# EAGLE schematic MTX_Tap_an_er_V11 (EAGLE 6.5.0)

## Sheet 1 of 2
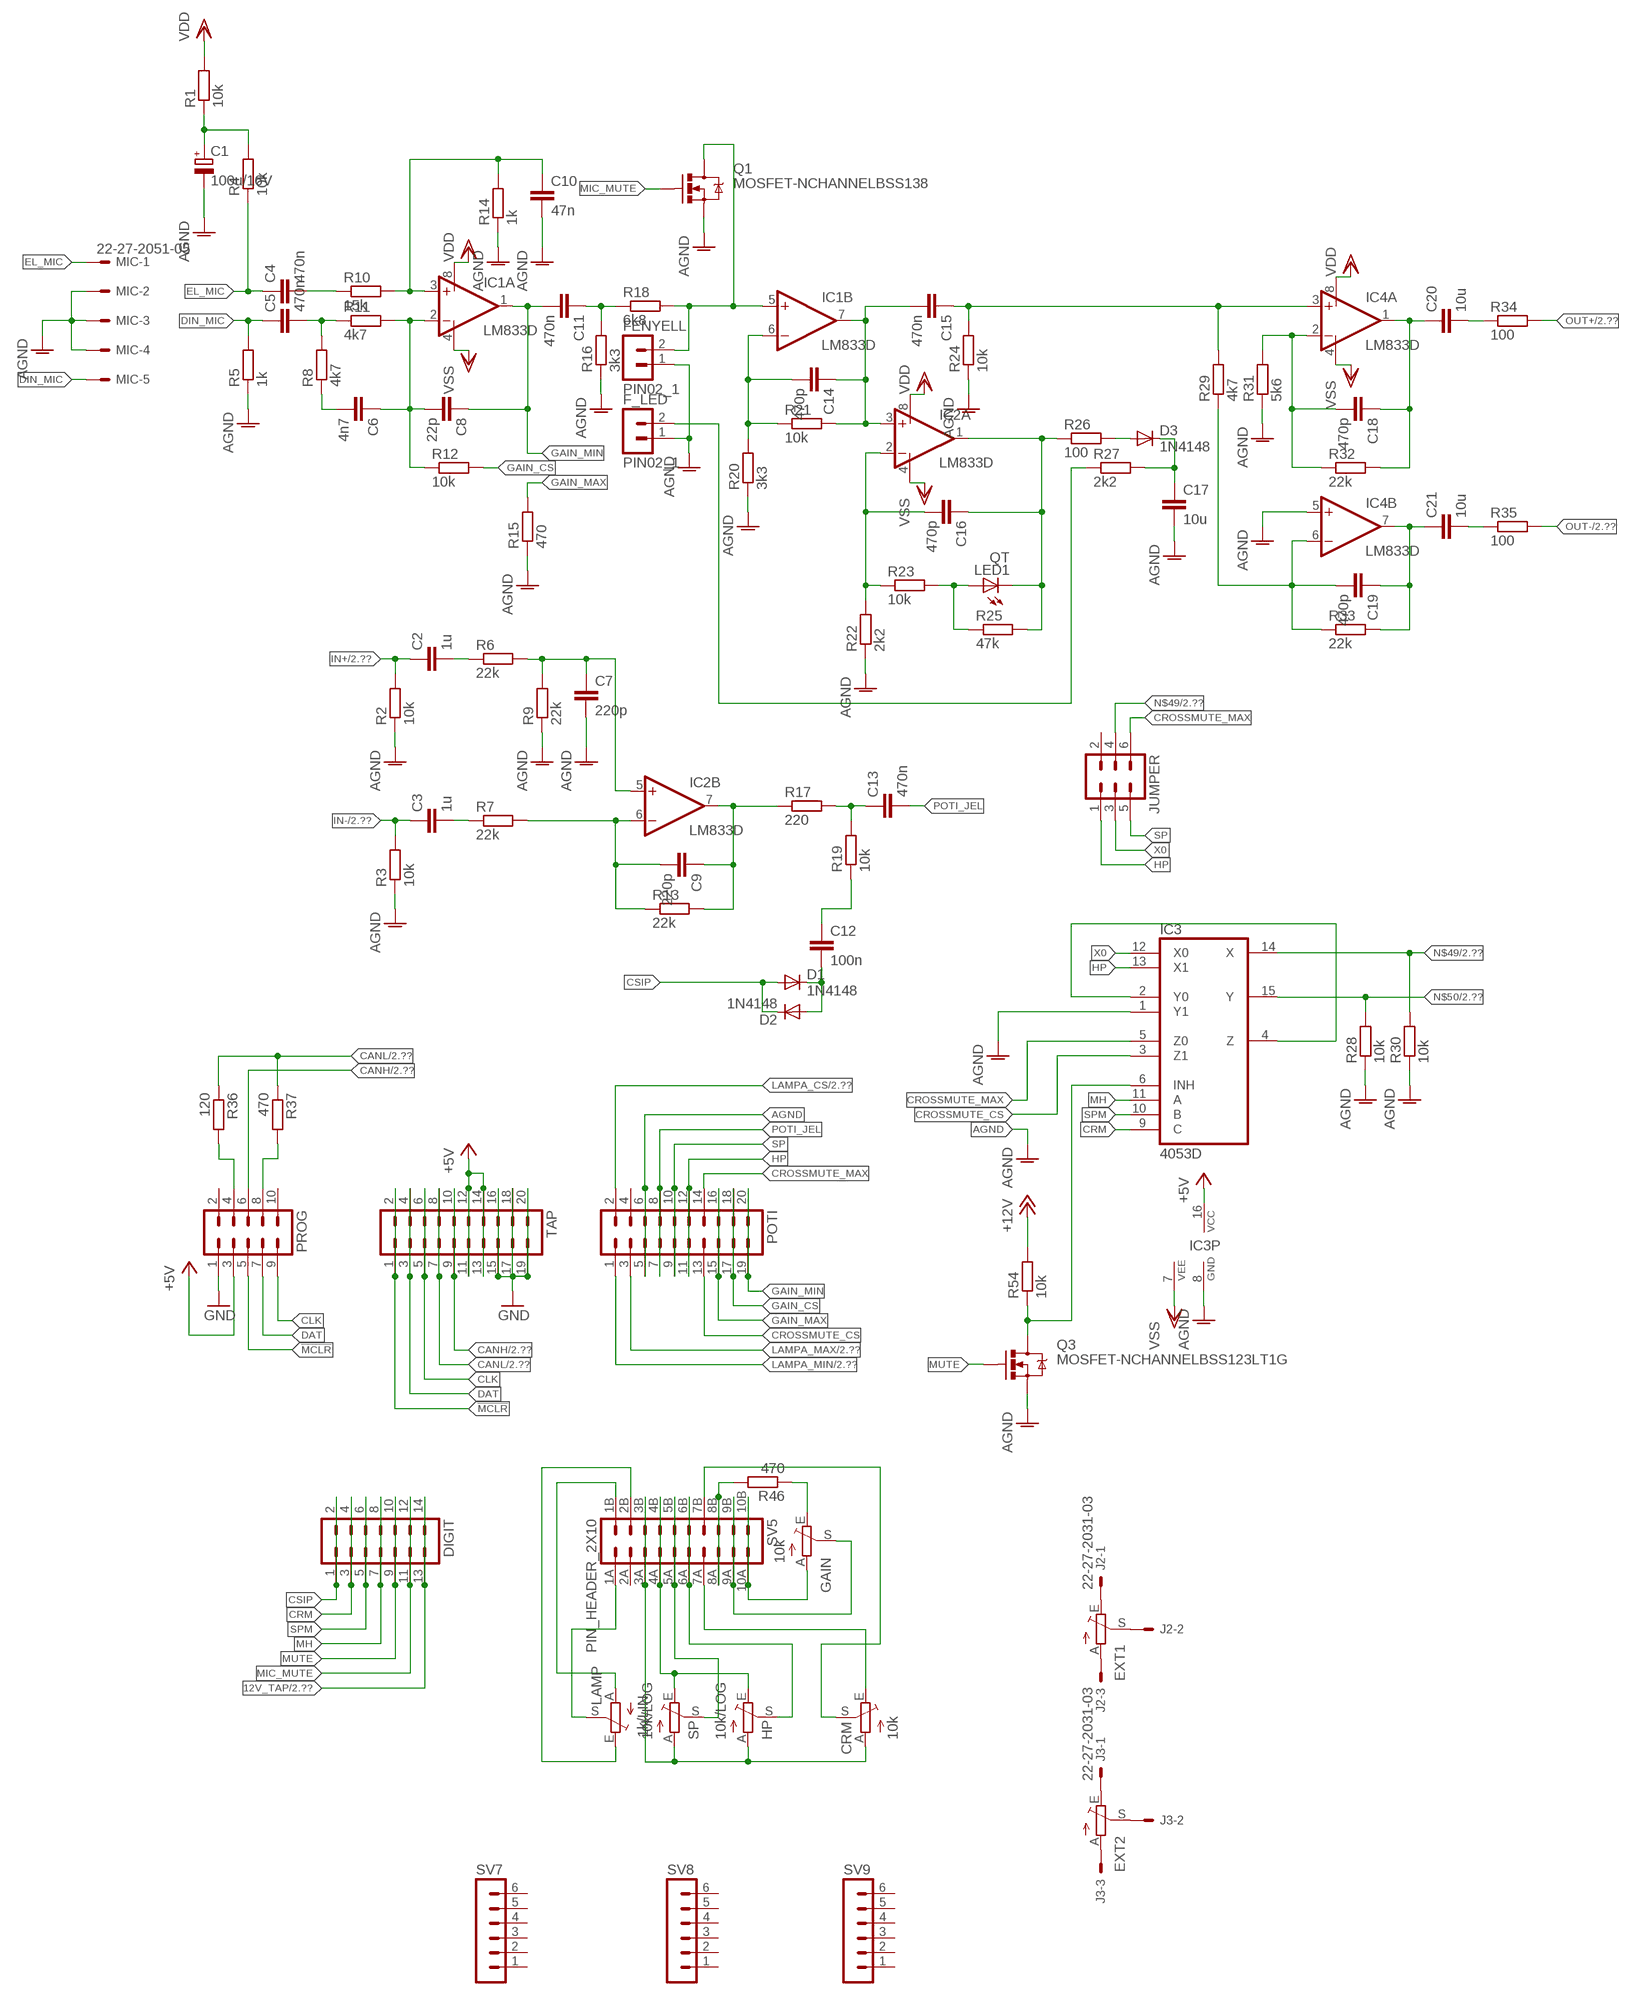
[diagram p0: schematic, sheet 1]

### Parts
C1  100u/16V  CPOL-EUE2.5-5  [E2,5-5]
C2  1u  C-EUC0805  [C0805]
C3  1u  C-EUC0805  [C0805]
C4  470n  C-EUC0805  [C0805]
C5  470n  C-EUC0805  [C0805]
C6  4n7  C-EUC0805  [C0805]
C7  220p  C-EUC0805  [C0805]
C8  22p  C-EUC0805  [C0805]
C9  220p  C-EUC0805  [C0805]
C10  47n  C-EUC0805  [C0805]
C11  470n  C-EUC0805  [C0805]
C12  100n  C-EUC0805  [C0805]
C13  470n  C-EUC0805  [C0805]
C14  470p  C-EUC0805  [C0805]
C15  470n  C-EUC0805  [C0805]
C16  470p  C-EUC0805  [C0805]
C17  10u  C-EUC0805  [C0805]
C18  470p  C-EUC0805  [C0805]
C19  470p  C-EUC0805  [C0805]
C20  10u  C-EUC0805  [C0805]
C21  10u  C-EUC0805  [C0805]
CRM  10k  TRIM_EU-PT10  [PT-10]
D1  1N4148  DIODE-SOD80C  [SOD80C]
D2  1N4148  DIODE-SOD80C  [SOD80C]
D3  1N4148  DIODE-SOD80C  [SOD80C]
DIGIT  MA07-2  [MA07-2]
EXT1  TRIM_EU-PT10  [PT-10]
EXT2  TRIM_EU-PT10  [PT-10]
F_LED  PIN02_1  [PIN02_1]
FENYELL  PIN02_1  [PIN02_1]
GAIN  10k  TRIM_EU-PT10  [PT-10]
HP  10k/LOG  TRIM_EU-POT_WHOLE  [POT_NAR]
IC1  LM833D  [SO08]
IC2  LM833D  [SO08]
IC3  4053D  [SO16]
IC4  LM833D  [SO08]
J2  22-27-2031-03  [6410-03]
J3  22-27-2031-03  [6410-03]
JUMPER  MA03-2  [MA03-2]
LAMP  1k/LIN  TRIM_EU-POT_WHOLE  [POT_NAR]
LED1  QT  LED3MM  [LED3MM]
MIC  22-27-2051-05  [6410-05]
POTI  MA10-2  [MA10-2]
PROG  ML10L  [ML10L]
Q1  MOSFET-NCHANNELBSS138  [SOT23]
Q3  MOSFET-NCHANNELBSS123LT1G  [SOT23]
R1  10k  R-EU_R0805  [R0805]
R2  10k  R-EU_R0805  [R0805]
R3  10k  R-EU_R0805  [R0805]
R4  10k  R-EU_R0805  [R0805]
R5  1k  R-EU_R0805  [R0805]
R6  22k  R-EU_R0805  [R0805]
R7  22k  R-EU_R0805  [R0805]
R8  4k7  R-EU_R0805  [R0805]
R9  22k  R-EU_R0805  [R0805]
R10  15k  R-EU_R0805  [R0805]
R11  4k7  R-EU_R0805  [R0805]
R12  10k  R-EU_R0805  [R0805]
R13  22k  R-EU_R0805  [R0805]
R14  1k  R-EU_R0805  [R0805]
R15  470  R-EU_R0805  [R0805]
R16  3k3  R-EU_R0805  [R0805]
R17  220  R-EU_R0805  [R0805]
R18  6k8  R-EU_R0805  [R0805]
R19  10k  R-EU_R0805  [R0805]
R20  3k3  R-EU_R0805  [R0805]
R21  10k  R-EU_R0805  [R0805]
R22  2k2  R-EU_R0805  [R0805]
R23  10k  R-EU_R0805  [R0805]
R24  10k  R-EU_R0805  [R0805]
R25  47k  R-EU_R0805  [R0805]
R26  100  R-EU_R0805  [R0805]
R27  2k2  R-EU_R0805  [R0805]
R28  10k  R-EU_R0805  [R0805]
R29  4k7  R-EU_R0805  [R0805]
R30  10k  R-EU_R0805  [R0805]
R31  5k6  R-EU_R0805  [R0805]
R32  22k  R-EU_R0805  [R0805]
R33  22k  R-EU_R0805  [R0805]
R34  100  R-EU_R0805  [R0805]
R35  100  R-EU_R0805  [R0805]
R36  120  R-EU_R0805  [R0805]
R37  470  R-EU_R0805  [R0805]
R46  470  R-EU_R0805  [R0805]
R54  10k  R-EU_R0805  [R0805]
SP  10k/LOG  TRIM_EU-POT_WHOLE  [POT_NAR]
SV5  PIN_HEADER_2X10  [PIN_HEADER_2X10SMD]
SV7  MA06-1  [MA06-1]
SV8  MA06-1  [MA06-1]
SV9  MA06-1  [MA06-1]
TAP  MA10-2  [MA10-2]

### Nets
1.: C9.1 IC2.7(B:OUT) R13.2 R17.1
12V_TAP: DIGIT.13 DIGIT.14 ; also sheet 2
!MCLR: PROG.5 TAP.1 TAP.2
+5V: IC3.16(VCC) PROG.3 TAP.11 TAP.12 TAP.13 TAP.14 ; also sheet 2
+12V: R54.2 ; also sheet 2
AGND: C1.- C7.2 C10.2 C17.2 F_LED.1 FENYELL.1 IC3.1(Y1) IC3.8(GND) IC4.5(B:+IN) MIC.2 MIC.3 MIC.4 POTI.5 POTI.6 Q1.2(S) Q3.2(S) R2.1 R3.1 R5.1 R9.1 R14.1 R15.1 R16.1 R20.1 R22.1 R24.1 R28.1 R30.1 R31.1 ; also sheet 2
CANH: PROG.6 TAP.9 TAP.10 ; also sheet 2
CANL: R36.1 R37.1 TAP.7 TAP.8 ; also sheet 2
CLK: PROG.9 TAP.5 TAP.6
CRM: DIGIT.3 DIGIT.4 IC3.9(C)
CROSSMUTE_CS: IC3.3(Z1) POTI.13
CROSSMUTE_MAX: IC3.5(Z0) JUMPER.6 POTI.14
CSIP: D1.A D2.C DIGIT.1 DIGIT.2
DAT: PROG.7 TAP.3 TAP.4
DIN_MIC: C5.1 MIC.5 R5.2
EL_MIC: C4.1 MIC.1 R4.1
GAIN_CS: POTI.17 POTI.18 R12.2
GAIN_MAX: POTI.15 POTI.16 R15.2
GAIN_MIN: C8.1 C11.2 IC1.1(A:OUT) POTI.19 POTI.20
GND: PROG.1 TAP.15 TAP.16 TAP.17 TAP.18 TAP.19 TAP.20 ; also sheet 2
HP: IC3.13(X1) JUMPER.1 POTI.11 POTI.12
IN+: C2.1 R2.2 ; also sheet 2
IN-: C3.1 R3.2 ; also sheet 2
LAMPA_CS: POTI.2 ; also sheet 2
LAMPA_MAX: POTI.3 ; also sheet 2
LAMPA_MIN: POTI.1 ; also sheet 2
MH: DIGIT.7 DIGIT.8 IC3.11(A)
MIC_MUTE: DIGIT.11 DIGIT.12 Q1.1(G)
MUTE: DIGIT.9 DIGIT.10 Q3.1(G)
N$1: C1.+ R1.1 R4.2
N$2: C4.2 R10.1
N$3: C5.2 R8.2 R11.1
N$4: C10.1 IC1.3(A:+IN) R10.2 R14.2
N$5: C6.1 C8.2 IC1.2(A:-IN) R11.2 R12.1
N$8: C6.2 R8.1
N$9: FENYELL.2 IC1.5(B:+IN) Q1.3(D) R18.2
N$10: CRM.E SV5.7A
N$11: CRM.A HP.A SP.A SV5.3A SV5.3B
N$12: IC3.2(Y0) IC3.4(Z)
N$13: C11.1 R16.2 R18.1
N$14: C18.2 IC4.2(A:-IN) R31.2 R32.1
N$15: C18.1 C20.1 IC4.1(A:OUT) R32.2
N$16: C14.2 IC1.6(B:-IN) R20.2 R21.1
N$17: C14.1 C15.2 IC1.7(B:OUT) IC2.3(A:+IN) R21.2
N$18: C16.2 IC2.2(A:-IN) R22.2 R23.1
N$19: C19.2 IC4.6(B:-IN) R29.1 R33.1
N$20: LED1.A R23.2 R25.1
N$21: C16.1 IC2.1(A:OUT) LED1.K(C) R25.2 R26.1
N$22: D3.A R26.2
N$23: C17.1 D3.C R27.2
N$24: F_LED.2 R27.1
N$25: C15.1 IC4.3(A:+IN) R24.2 R29.2
N$26: C19.1 C21.1 IC4.7(B:OUT) R33.2
N$27: C21.2 R35.1
N$28: C20.2 R34.1
N$29: C2.2 R6.1
N$30: HP.E SP.E SV5.4A SV5.4B
N$31: C7.1 IC2.5(B:+IN) R6.2 R9.2
N$32: C3.2 R7.1
N$33: SP.S SV5.5A SV5.5B
N$35: C12.2 D1.C D2.A
N$36: C9.2 IC2.6(B:-IN) R7.2 R13.1
N$37: EXT1.S J2.2
N$38: EXT2.S J3.2
N$39: C13.1 R17.2 R19.2
N$40: C12.1 R19.1
N$41: EXT1.E J2.1
N$42: EXT1.A J2.3
N$43: LAMP.S SV5.1A
N$44: EXT2.A J3.3
N$45: EXT2.E J3.1
N$47: LAMP.E SV5.2B
N$48: HP.S SV5.6A SV5.6B
N$49: IC3.14(X) JUMPER.4 R30.2 ; also sheet 2
N$50: IC3.15(Y) R28.2 ; also sheet 2
N$51: PROG.8 R37.2
N$56: LAMP.A SV5.1B
N$57: PROG.4 R36.2
N$58: CRM.S SV5.7B
N$59: IC3.6(INH) Q3.3(D) R54.1
N$68: R46.2 SV5.8A SV5.8B
N$69: GAIN.S SV5.9A SV5.9B
N$70: GAIN.A SV5.10A SV5.10B
N$73: GAIN.E R46.1
OUT+: R34.2 ; also sheet 2
OUT-: R35.2 ; also sheet 2
POTI_JEL: C13.2 POTI.7 POTI.8
SP: JUMPER.5 POTI.9 POTI.10
SPM: DIGIT.5 DIGIT.6 IC3.10(B)
VDD: IC1.8(P:V+) IC2.8(P:V+) IC4.8(P:V+) R1.2 ; also sheet 2
VSS: IC1.4(P:V-) IC2.4(P:V-) IC3.7(VEE) IC4.4(P:V-) ; also sheet 2
X0: IC3.12(X0) JUMPER.3
Unconnected: JUMPER.2 POTI.4 PROG.2 PROG.10 SV5.2A SV7.1 SV7.2 SV7.3 SV7.4 SV7.5 SV7.6 SV8.1 SV8.2 SV8.3 SV8.4 SV8.5 SV8.6 SV9.1 SV9.2 SV9.3 SV9.4 SV9.5 SV9.6

## Sheet 2 of 2
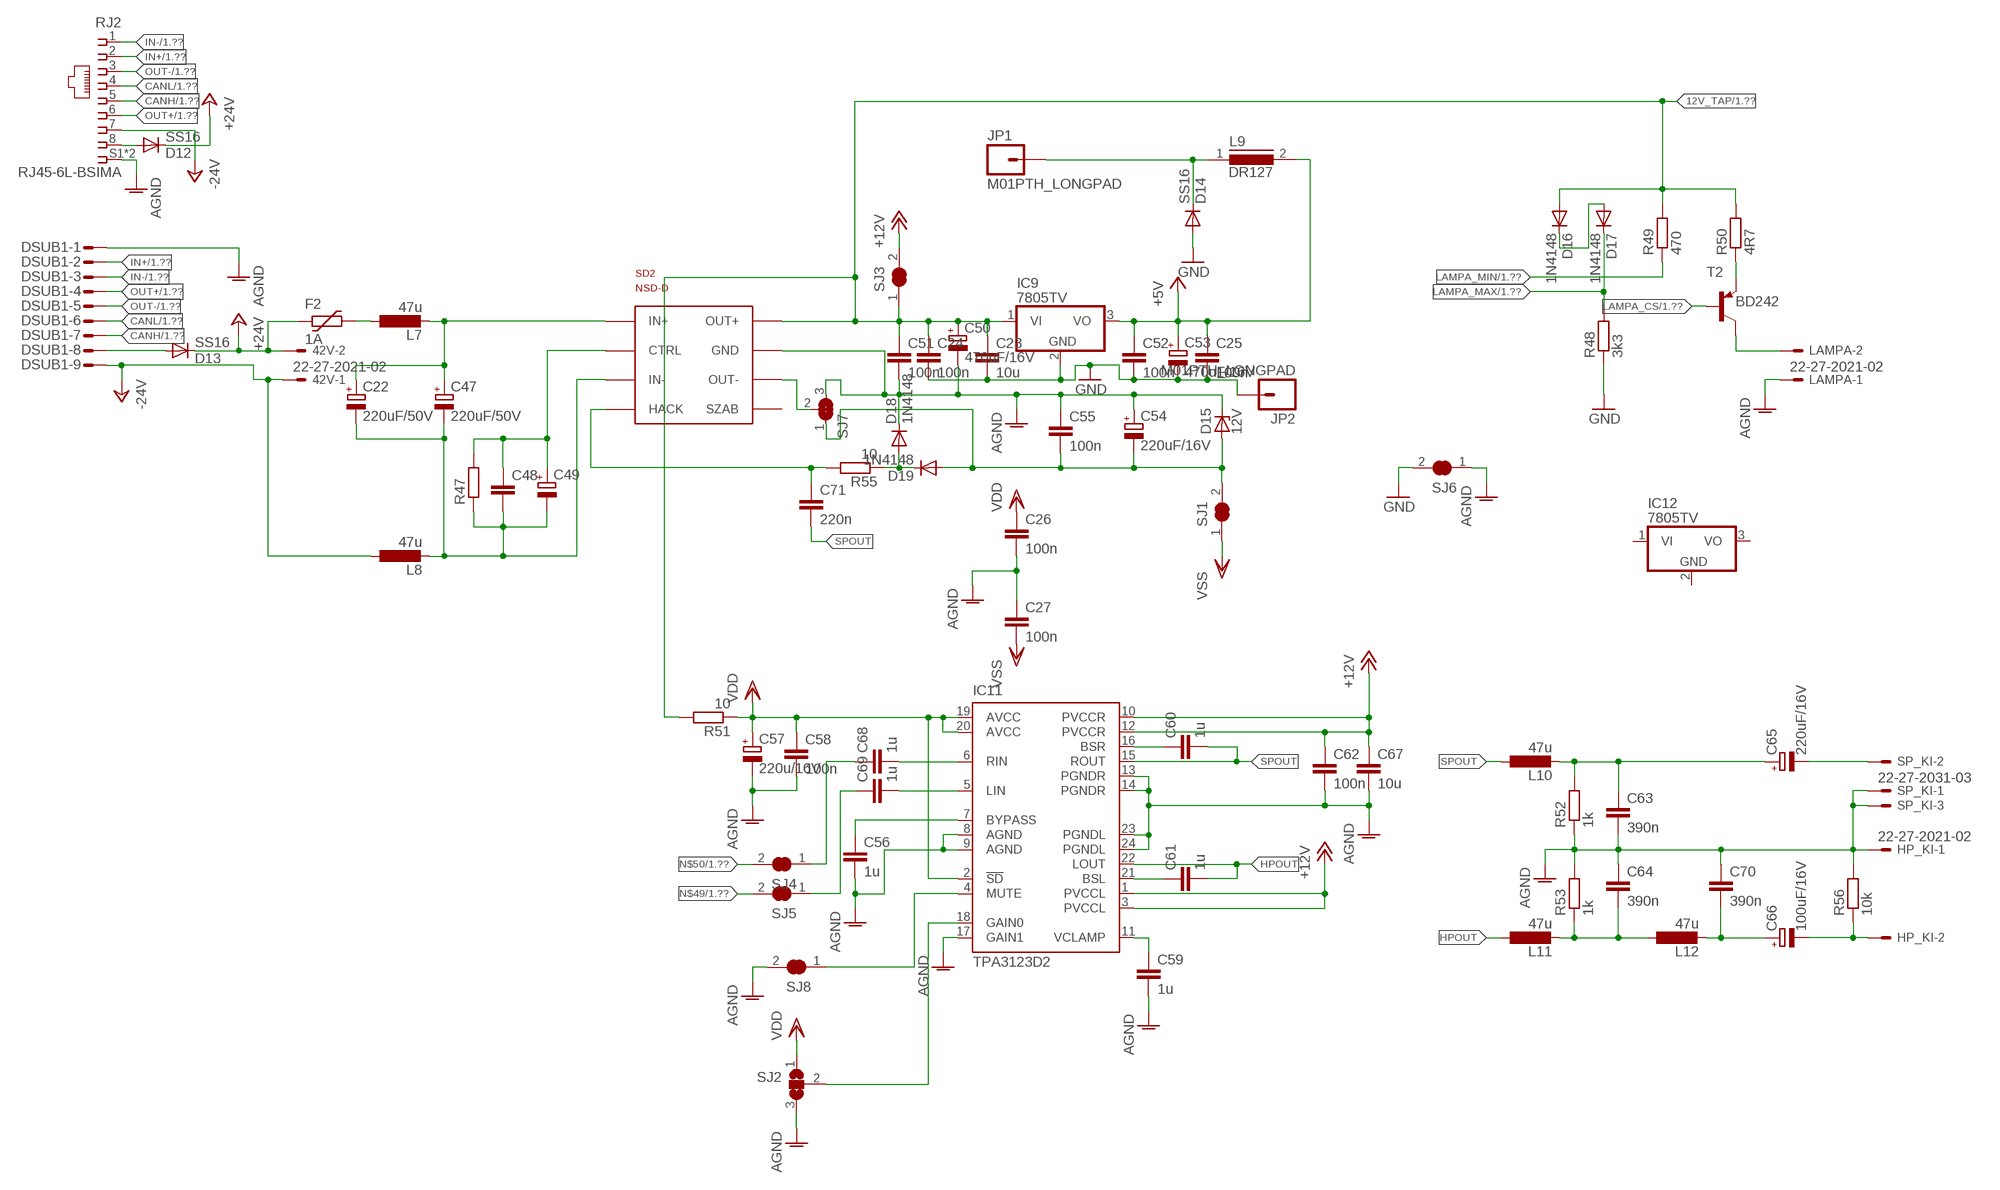
[diagram p1: schematic, sheet 2]

### Parts
42V  22-27-2021-02  [6410-02]
C22  220uF/50V  CPOL-EUE3.5-8  [E3,5-8]
C23  10u  C-EUC0805  [C0805]
C24  100n  C-EUC0805  [C0805]
C25  100n  C-EUC0805  [C0805]
C26  100n  C-EUC0805  [C0805]
C27  100n  C-EUC0805  [C0805]
C47  220uF/50V  CPOL-EUE3.5-8  [E3,5-8]
C48  C-EUC0805  [C0805]
C49  CPOL-EUE2.5-5  [E2,5-5]
C50  470uF/16V  CPOL-EUE3.5-8  [E3,5-8]
C51  100n  C-EUC0805  [C0805]
C52  100n  C-EUC0805  [C0805]
C53  470uF/16V  CPOL-EUE3.5-8  [E3,5-8]
C54  220uF/16V  CPOL-EUE2.5-7  [E2,5-7]
C55  100n  C-EUC0805  [C0805]
C56  1u  C-EUC0805  [C0805]
C57  220u/16V  CPOL-EUE2.5-7  [E2,5-7]
C58  100n  C-EUC0805  [C0805]
C59  1u  C-EUC0805  [C0805]
C60  1u  C-EUC0805  [C0805]
C61  1u  C-EUC0805  [C0805]
C62  100n  C-EUC0805  [C0805]
C63  390n  C-EUC0805  [C0805]
C64  390n  C-EUC0805  [C0805]
C65  220uF/16V  CPOL-EUE2.5-7  [E2,5-7]
C66  100uF/16V  CPOL-EUE2.5-6  [E2,5-6]
C67  10u  C-EUC0805  [C0805]
C68  1u  C-EUC0805  [C0805]
C69  1u  C-EUC0805  [C0805]
C70  390n  C-EUC0805  [C0805]
C71  220n  C-EUC0805  [C0805]
D12  SS16  DIODE-DO-214AC  [DO-214AC]
D13  SS16  DIODE-DO-214AC  [DO-214AC]
D14  SS16  DIODE-DO-214AC  [DO-214AC]
D15  12V  ZENER-DIODESOD80C  [SOD80C]
D16  1N4148  DIODE-SOD80C  [SOD80C]
D17  1N4148  DIODE-SOD80C  [SOD80C]
D18  1N4148  DIODE-SOD80C  [SOD80C]
D19  1N4148  DIODE-SOD80C  [SOD80C]
DSUB1  M09-182S  [182-009-MALE]
F2  1A  FUSE_PTC-1812  [PTC1812L]
HP_KI  22-27-2021-02  [6410-02]
IC9  7805TV  [TO220V]
IC11  TPA3123D2  [PWP-TSSOP24]
IC12  7805TV  [TO220V]
JP1  M01PTH_LONGPAD  [1X01_LONGPAD]
JP2  M01PTH_LONGPAD  [1X01_LONGPAD]
L7  47u  L-EUPIS2816  [PIS2816]
L8  47u  L-EUPIS2816  [PIS2816]
L9  DR127  [DR127]
L10  47u  L-EUPIS2816  [PIS2816]
L11  47u  L-EUPIS2816  [PIS2816]
L12  47u  L-EUPIS2816  [PIS2816]
LAMPA  22-27-2021-02  [6410-02]
R47  R-EU_R0805  [R0805]
R48  3k3  R-EU_R0805  [R0805]
R49  470  R-EU_R0805  [R0805]
R50  4R7  R-EU_R0805  [R0805]
R51  10  R-EU_R1210  [R1210]
R52  1k  R-EU_R0805  [R0805]
R53  1k  R-EU_R0805  [R0805]
R55  10  R-EU_R0805  [R0805]
R56  10k  R-EU_R0805  [R0805]
RJ2  RJ45-6L-BSIMA  [RJ45]
SD2  NSD-D  [NSD-D]
SJ1  SOLDERJUMPER_CLOSED  [SOLDERJUMPER_CLOSEDWIRE]
SJ2  SJ2W  [SJ_2]
SJ3  SOLDERJUMPER_CLOSED  [SOLDERJUMPER_CLOSEDWIRE]
SJ4  SOLDERJUMPER_CLOSED  [SOLDERJUMPER_CLOSEDWIRE]
SJ5  SOLDERJUMPER_CLOSED  [SOLDERJUMPER_CLOSEDWIRE]
SJ6  SOLDERJUMPER_CLOSED  [SOLDERJUMPER_CLOSEDWIRE]
SJ7  SOLDERJUMPER_2WAY  [SOLDERJUMPER_2WAY_OPEN_NOPASTE]
SJ8  SOLDERJUMPER_CLOSED  [SOLDERJUMPER_CLOSEDWIRE]
SP_KI  22-27-2031-03  [6410-03]
T2  BD242  -PNP-TO220V  [TO220V]

### Nets
12V_TAP: C23.1 C24.1 C50.+ C51.1 D16.A IC9.1(VI) R49.2 R50.2 R51.2 SD2.OUT+ SJ3.1 ; also sheet 1
+5V: C25.1 C52.1 C53.+ IC9.3(VO) L9.2 ; also sheet 1
+12V: C62.1 C67.1 IC11.1(PVCCL) IC11.3(PVCCL) IC11.10(PVCCR) IC11.12(PVCCR) SJ3.2 ; also sheet 1
+24V: 42V.2 D12.1(C) D13.1(C) F2.1
-24V: 42V.1 DSUB1.9 L8.1 RJ2.7
AGND: C26.2 C27.1 C50.- C51.2 C54.+ C55.1 C56.2 C57.- C58.2 C59.2 C62.2 C63.2 C64.1 C67.2 C70.1 D15.C D18.C DSUB1.1 HP_KI.1 IC11.8(AGND) IC11.9(AGND) IC11.13(PGNDR) IC11.14(PGNDR) IC11.17(GAIN1) IC11.23(PGNDL) IC11.24(PGNDL) LAMPA.1 R52.1 R53.2 R56.2 RJ2.S1(S) RJ2.S2(S) SD2.COMMON(GND) SJ2.3 SJ6.1 SJ7.3 SJ8.2 SP_KI.1 SP_KI.3 ; also sheet 1
CANH: DSUB1.7 RJ2.5 ; also sheet 1
CANL: DSUB1.6 RJ2.4 ; also sheet 1
GND: C23.2 C24.2 C25.2 C52.2 C53.- D14.2(A) IC9.2(GND) JP2.1 R48.1 SJ6.2 ; also sheet 1
HPIN_X: C69.1 SJ5.1
HPOUT: C61.2 IC11.22(LOUT) L11.1
IN+: DSUB1.2 RJ2.2 ; also sheet 1
IN-: DSUB1.3 RJ2.1 ; also sheet 1
LAMPA_CS: T2.1(B) ; also sheet 1
LAMPA_MAX: D17.C R48.2 ; also sheet 1
LAMPA_MIN: R49.1 ; also sheet 1
N$6: C54.- C55.2 D15.A D19.A SJ1.2 SJ7.1
N$7: D12.2(A) RJ2.8
N$34: C65.- SP_KI.2
N$46: SD2.OUT- SJ7.2
N$49: SJ5.2 ; also sheet 1
N$50: SJ4.2 ; also sheet 1
N$55: C71.1 R55.2 SD2.HACK
N$71: D13.2(A) DSUB1.8
N$72: F2.2 L7.1
N$74: C22.+ C47.+ L7.2 SD2.INPUT+(IN+)
N$75: C48.1 C49.+ R47.2 SD2.CONTROL(CTRL)
N$76: C22.- C47.- C48.2 C49.- L8.2 R47.1 SD2.INPUT-(IN-)
N$77: D14.1(C) JP1.1 L9.1
N$78: R50.1 T2.3(E)
N$80: D16.C D17.A
N$81: LAMPA.2 T2.2(C)
N$82: C56.1 IC11.7(BYPASS)
N$83: C59.1 IC11.11(VCLAMP)
N$84: C61.1 IC11.21(BSL)
N$85: C60.1 IC11.16(BSR)
N$86: C63.1 C65.+ L10.2 R52.2
N$87: C64.2 L11.2 L12.1 R53.1
N$89: C66.- HP_KI.2 R56.1
N$90: C68.2 IC11.6(RIN)
N$91: C69.2 IC11.5(LIN)
N$92: IC11.18(GAIN0) SJ2.2
N$93: IC11.4(MUTE) SJ8.1
N$94: D18.A D19.C R55.1
N$95: C66.+ C70.2 L12.2
OUT+: DSUB1.4 RJ2.6 ; also sheet 1
OUT-: DSUB1.5 RJ2.3 ; also sheet 1
SPIN_X: C68.1 SJ4.1
SPOUT: C60.2 C71.2 IC11.15(ROUT) L10.1
VDD: C26.1 C57.+ C58.1 IC11.2(!SD) IC11.19(AVCC) IC11.20(AVCC) R51.1 SJ2.1 ; also sheet 1
VSS: C27.2 SJ1.1 ; also sheet 1
Unconnected: IC12.1(VI) IC12.2(GND) IC12.3(VO) SD2.SZAB

## Library data of the parts
42V HP_KI LAMPA = con-molex:22-?-02: CONNECTOR wire to board 2.54 mm (.1 inch) pitch header; OC_FARNELL: unknown; OC_NEWARK: unknown
C1 C22 C47 C49 C50 C53 C54 C57 C65 C66 = rcl:CPOL-EU: POLARIZED CAPACITOR, European symbol
C2-C21 C23-C27 C48 C51 C52 C55 C56 C58-C64 C67-C71 = rcl:C-EU: CAPACITOR, European symbol
CRM EXT1 EXT2 GAIN HP LAMP SP = pot:TRIM_EU-: POTENTIOMETER
D1-D3 D16-D19 = diode:DIODE-: DIODE
D12-D14 = dp_devices:DIODE: Various Diode Packages
D15 = diode:ZENER-DIODE: Z-Diode
DIGIT = con-lstb:MA07-2: PIN HEADER; OC_FARNELL: unknown; OC_NEWARK: unknown
DSUB1 = con-subd:M09?S: SUB-D; OC_FARNELL: unknown; OC_NEWARK: unknown
F2 = dp_devices:FUSE_PTC: Resettable PTC; TME: BSMD-T1.0A
F_LED FENYELL = Cf_Csatl:PIN02_1
IC1 IC2 IC4 = linear:LM833: OP AMP
IC3 = 40xx:4053: Triple 2-channel ANALOG MULTIPLEXER
IC9 IC12 = linear:78*: Positive VOLTAGE REGULATOR Source: http://cache.national.com/ds/LM/LM78L05.pdf http://www.fairchildsemi.com/ds/LM/LM7805.pdf
IC11 = texas:TPA3123D2: 25-W STEREO CLASS-D AUDIO POWER AMPLIFIER Please INVOKE gate EXP, set DRC-Clearance | Same signals | SMD - SMD = 0 Source: http://focus.ti.com/lit/ds/symlink/tpa3123d2.pdf; MPN: TPA3123D2PWP; OC_FARNELL: 1632099; OC_NEWARK: 53M3994
J2 J3 SP_KI = con-molex:22-?-03: CONNECTOR wire to board 2.54 mm (.1 inch) pitch header; OC_FARNELL: unknown; OC_NEWARK: unknown
JP1 JP2 = SparkFun-Connectors:M01: Header 1 Standard 1-pin 0.1" header. Use with straight break away headers (SKU : PRT-00116), right angle break away headers (PRT-00553), swiss pins (PRT-00743), machine pins (PRT-00117), and female headers (PRT-00115).
JUMPER = con-lstb:MA03-2: PIN HEADER; OC_FARNELL: unknown; OC_NEWARK: unknown
L7 L8 L10-L12 = rcl:L-EU: INDUCTOR, European symbol
L9 = inductors:DR127: High Power Density, High Efficiency, Shielded Inductors Source: coiltronics_dr_series.pdf
LED1 = led:LED: LED OSRAM: - CHIPLED LG R971, LG N971, LY N971, LG Q971, LY Q971, LO R971, LY R971 LH N974, LH R974 LS Q976, LO Q976, LY Q976 LO Q996 - Hyper CHIPLED LW Q18S LB Q993, LB Q99A, LB R99A - SideLED LS A670, LO A670, LY A670, LG A670, LP A670 LB A673, LV A673, LT A673, LW A673 LH A674 LY A675 LS A676, LA A676, LO A676, LY A676, LW A676 LS A679, LY A679, LG A679 - Hyper Micro SIDELED® LS Y876, LA Y876, LO Y876, LY Y876 LT Y87S - SmartLED LW L88C, LW L88S LB L89C, LB L89S, LG L890 LS L89K, LO L89K, LY L89K LS L896, LA L896, LO L896, LY L896 - TOPLED LS T670, LO T670, LY T670, LG T670, LP T670 LSG T670, LSP T670, LSY T670, LOP T670, LYG T670 LG T671, LOG T671, LSG T671 LB T673, LV T673, LT T673, LW T673 LH T674 LS T676, LA T676, LO T676, LY T676, LB T676, LH T676, LSB T676, LW T676 LB T67C, LV T67C, LT T67C, LS T67K, LO T67K, LY T67K, LW E67C LS E67B, LA E67B, LO E67B, LY E67B, LB E67C, LV E67C, LT E67C LW T67C LS T679, LY T679, LG T679 LS T770, LO T770, LY T770, LG T770, LP T770 LB T773, LV T773, LT T773, LW T773 LH T774 LS E675, LA E675, LY E675, LS T675 LS T776, LA T776, LO T776, LY T776, LB T776 LHGB T686 LT T68C, LB T68C - Hyper Mini TOPLED® LB M676 - Mini TOPLED Santana® LG M470 LS M47K, LO M47K, LY M47K Source: http://www.osram.convergy.de LUXEON: - LUMILED® LXK2-PW12-R00, LXK2-PW12-S00, LXK2-PW14-U00, LXK2-PW14-V00 LXK2-PM12-R00, LXK2-PM12-S00, LXK2-PM14-U00 LXK2-PE12-Q00, LXK2-PE12-R00, LXK2-PE12-S00, LXK2-PE14-T00, LXK2-PE14-U00 LXK2-PB12-K00, LXK2-PB12-L00, LXK2-PB12-M00, LXK2-PB14-N00, LXK2-PB14-P00, LXK2-PB14-Q00 LXK2-PR12-L00, LXK2-PR12-M00, LXK2-PR14-Q00, LXK2-PR14-R00 LXK2-PD12-Q00, LXK2-PD12-R00, LXK2-PD12-S00 LXK2-PH12-R00, LXK2-PH12-S00 LXK2-PL12-P00, LXK2-PL12-Q00, LXK2-PL12-R00 Source: www.luxeon.com KINGBRIGHT: KA-3528ASYC Source: www.kingbright.com
MIC = con-molex:22-?-05: CONNECTOR wire to board 2.54 mm (.1 inch) pitch header; OC_FARNELL: unknown; OC_NEWARK: unknown
POTI TAP = con-lstb:MA10-2: PIN HEADER; OC_FARNELL: unknown; OC_NEWARK: unknown
PROG = con-harting-ml:ML10: HARTING; OC_FARNELL: unknown; OC_NEWARK: unknown
Q1 = SparkFun-DiscreteSemi:MOSFET-NCHANNEL: Common NMOSFET Parts MFG P/N Store ID Prod ID FDD8780 TRANS-09984 SI7820DN TRANS-11055 FDS6630A IC-08089 2N7002PW TRANS-11151 FQP30N06L COM-10213 TRANS-10060 BSS123LT1G TRANS-08345 BSS138 TRANS-00830 BS170 2N7000; PROD_ID: TRANS-00830
Q3 = SparkFun-DiscreteSemi:MOSFET-NCHANNEL: Common NMOSFET Parts MFG P/N Store ID Prod ID FDD8780 TRANS-09984 SI7820DN TRANS-11055 FDS6630A IC-08089 2N7002PW TRANS-11151 FQP30N06L COM-10213 TRANS-10060 BSS123LT1G TRANS-08345 BSS138 TRANS-00830 BS170 2N7000; PROD_ID: TRANS-08345
R1-R37 R46-R56 = rcl:R-EU_: RESISTOR, European symbol
RJ2 = Cf_Csatl:RJ45: CORCOM Modular RJ Jacks No Shield Source: www.tycoelectronics.com .. ENG_DS_1654001_1099_RJ_L_0507.pdf; MPN: RJ45-6L-B; OC_FARNELL: unknown; OC_NEWARK: 16R6090
SD2 = meanwell:NSD-D
SJ1 SJ3-SJ6 SJ8 = microbuilder:SOLDERJUMPER_CLOSED: Solder Jumper - Closed These solder jumpers are closed by default CLOSEDWIRE - 10 mil trace between pads that can be cut and resoldered later CLOSEDPERM - 63 mil trace between pads for a permanent connection (used to 'bridge' two signals, a shameless hack for Eagle). Can double as a test point as well (no cream layer)
SJ2 = jumper:SJ2W: SMD solder JUMPER
SJ7 = microbuilder:SOLDERJUMPER_2WAY: 2-Way Solder Jumper
SV5 = narval:PIN_HEADER_2X10
SV7-SV9 = con-lstb:MA06-1: PIN HEADER; OC_FARNELL: unknown; OC_NEWARK: unknown
T2 = transistor:*-PNP-: PNP Transistror